# Altium schematic sheet Power.SchDoc: nRF2789_Dual_Wireless_Mic_RX
size A4; DrawnBy: ANOL; Revision: 1.0
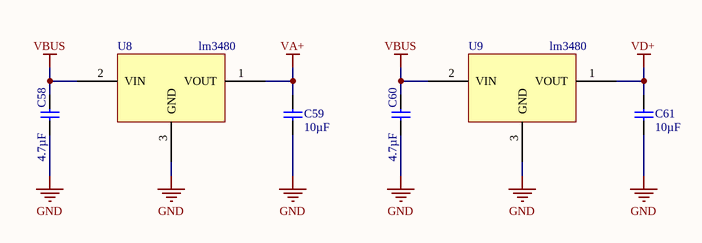
[diagram p0: Power.SchDoc]

## Parts
C58  4.7µF  [0805]
C59  10µF  [0805]
C60  4.7µF  [0805]
C61  10µF  [0805]
U8  lm3480  [SOT95P237X112-3N]
U9  lm3480  [SOT95P237X112-3N]

## Nets
GND: C58.1 C59.1 C60.1 C61.1 U8.3(GND) U9.3(GND)
VA+: C59.2 U8.1(VOUT)
VBUS: C58.2 C60.2 U8.2(VIN) U9.2(VIN)
VD+: C61.2 U9.1(VOUT)

## Library data of the parts
C58 C60 = C0805-4µ7: Chip Cap 0805; Note: Chip Cap 10%; Artikkelnr Noca: 20039266; Part Number: C0805-4µ7; Manufacturer: *; Manufacturer Part Number: *; Datasheet: *; LatestRevisionDate: 2009-11-23; Pin Count: 2; Publisher: Nordic Semiconductor; Published: 2009-08-21; Value: 4.7µF; Supplier: *; Supplier part number: *; 2nd source Supplier: *; 2nd source part number: *
C59 C61 = C0805-10µ: Chip Cap 0805; Note: Chip Cap 10%; Artikkelnr Noca: 20039243; Part Number: C0805-10µ; Manufacturer: *; Manufacturer Part Number: *; Datasheet: *; LatestRevisionDate: 2010-06-03; Pin Count: 2; Publisher: Nordic Semiconductor; Published: 2010-06-03; Value: 10µF; Supplier: *; Supplier part number: *; 2nd source Supplier: *; 2nd source part number: *